# EAGLE design Keypad 4x4 (EAGLE 9.6.2)
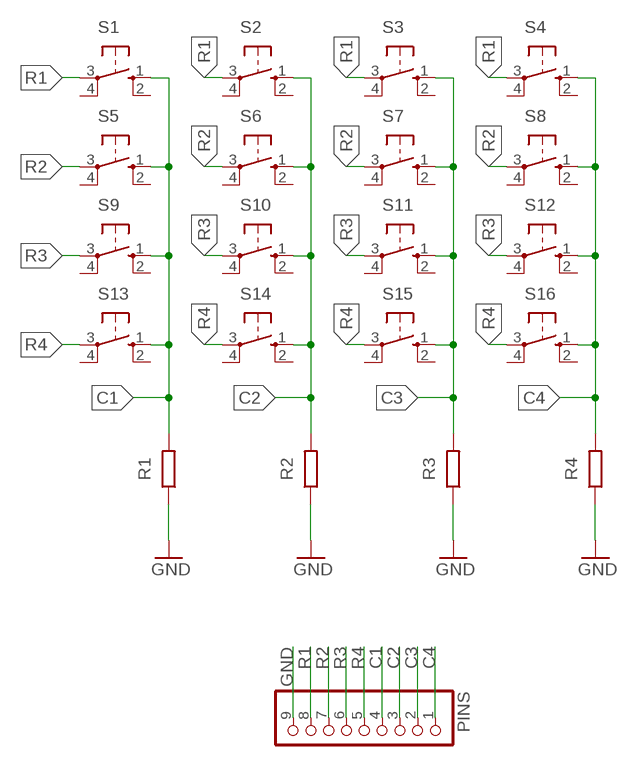
[diagram p0: schematic, sheet 1]

## Parts
PINS  PINHD-1X9/90  [1X09/90]
R1  100k  R-EU_0204/7  [0204/7]
R2  100k  R-EU_0204/7  [0204/7]
R3  100k  R-EU_0204/7  [0204/7]
R4  100k  R-EU_0204/7  [0204/7]
S1  10-XX  [B3F-10XX]
S2  10-XX  [B3F-10XX]
S3  10-XX  [B3F-10XX]
S4  10-XX  [B3F-10XX]
S5  10-XX  [B3F-10XX]
S6  10-XX  [B3F-10XX]
S7  10-XX  [B3F-10XX]
S8  10-XX  [B3F-10XX]
S9  10-XX  [B3F-10XX]
S10  10-XX  [B3F-10XX]
S11  10-XX  [B3F-10XX]
S12  10-XX  [B3F-10XX]
S13  10-XX  [B3F-10XX]
S14  10-XX  [B3F-10XX]
S15  10-XX  [B3F-10XX]
S16  10-XX  [B3F-10XX]

## Nets
C1: PINS.4 R1.2 S1.1(S) S5.1(S) S9.1(S) S13.1(S)
C2: PINS.3 R2.2 S2.1(S) S6.1(S) S10.1(S) S14.1(S)
C3: PINS.2 R3.2 S3.1(S) S7.1(S) S11.1(S) S15.1(S)
C4: PINS.1 R4.2 S4.1(S) S8.1(S) S12.1(S) S16.1(S)
GND: PINS.9 R1.1 R2.1 R3.1 R4.1
R1: PINS.8 S1.3(P) S2.3(P) S3.3(P) S4.3(P)
R2: PINS.7 S5.3(P) S6.3(P) S7.3(P) S8.3(P)
R3: PINS.6 S9.3(P) S10.3(P) S11.3(P) S12.3(P)
R4: PINS.5 S13.3(P) S14.3(P) S15.3(P) S16.3(P)
Unconnected: S1.2(S1) S1.4(P1) S2.2(S1) S2.4(P1) S3.2(S1) S3.4(P1) S4.2(S1) S4.4(P1) S5.2(S1) S5.4(P1) S6.2(S1) S6.4(P1) S7.2(S1) S7.4(P1) S8.2(S1) S8.4(P1) S9.2(S1) S9.4(P1) S10.2(S1) S10.4(P1) S11.2(S1) S11.4(P1) S12.2(S1) S12.4(P1) S13.2(S1) S13.4(P1) S14.2(S1) S14.4(P1) S15.2(S1) S15.4(P1) S16.2(S1) S16.4(P1)

## Library data of the parts
PINS = pinhead:PINHD-1X9: PIN HEADER
R1-R4 = rcl:R-EU_: RESISTOR, European symbol; SPICEPREFIX: R
S1-S16 = switch-omron:10-XX: OMRON SWITCH; MPN: B3F-1000; OC_FARNELL: 176432; OC_NEWARK: 36M3542

## Board
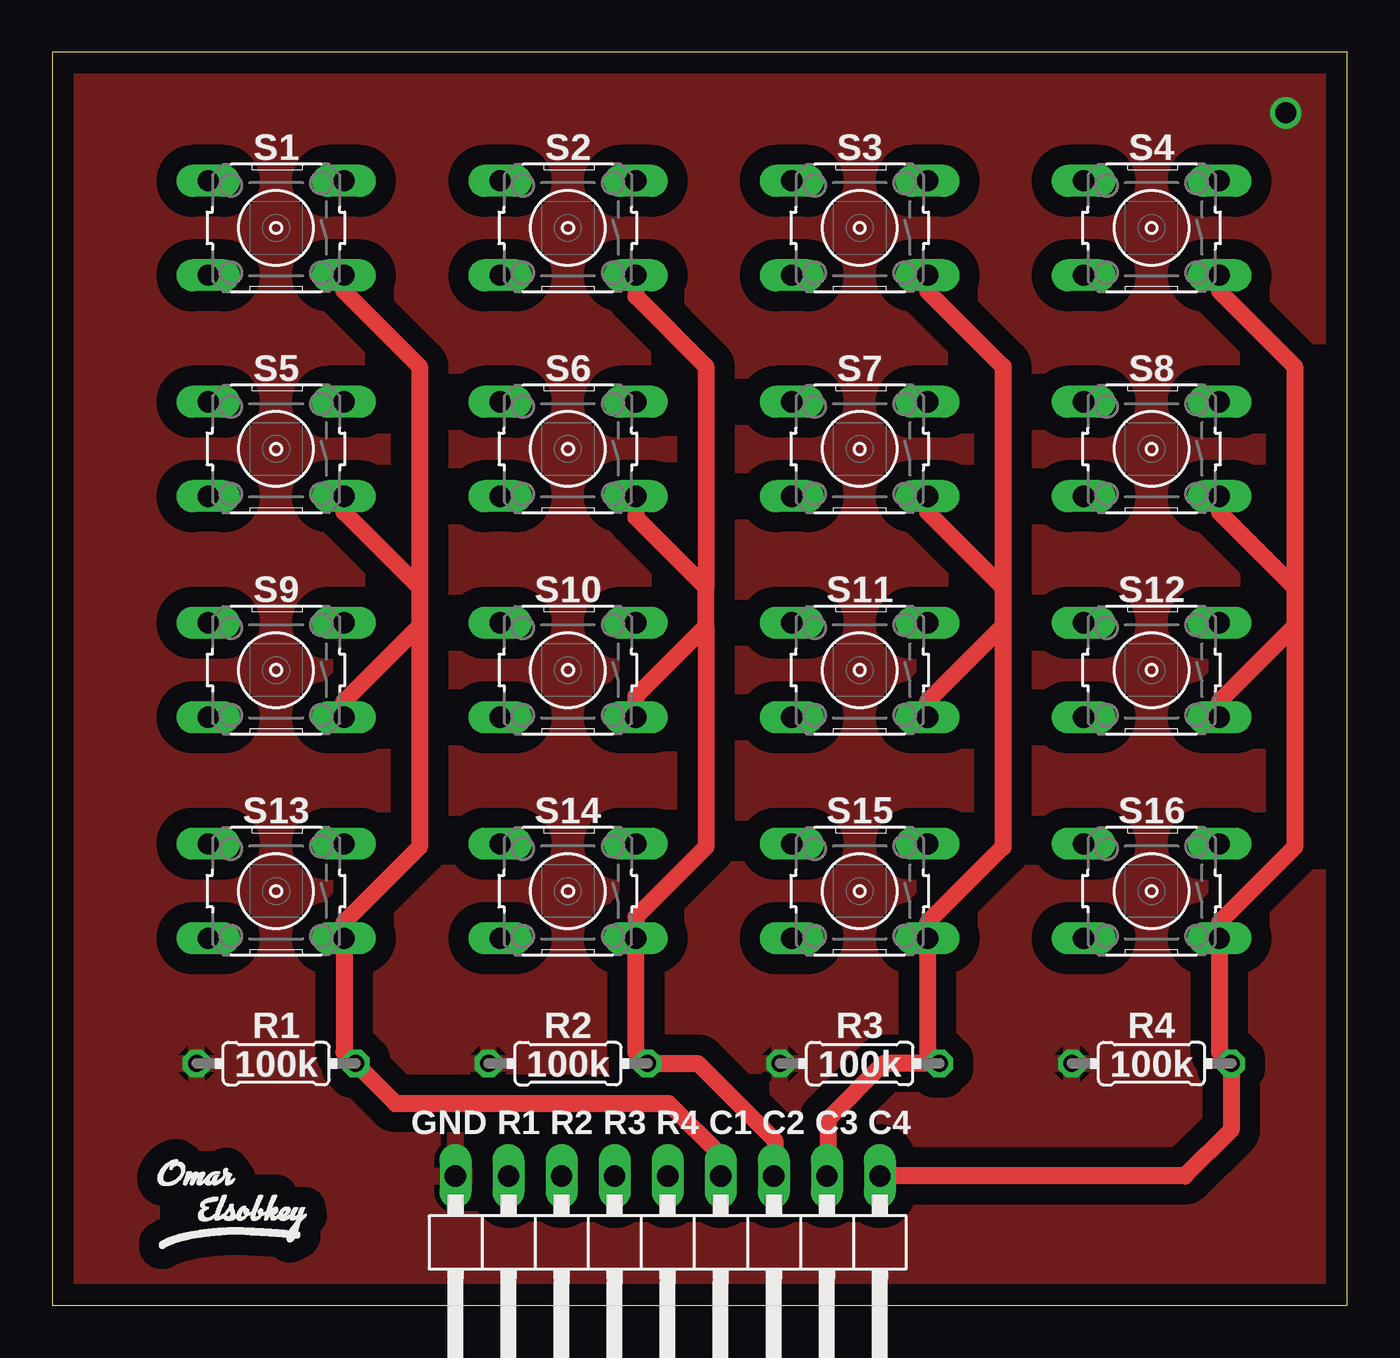
[diagram p1: board, top side]
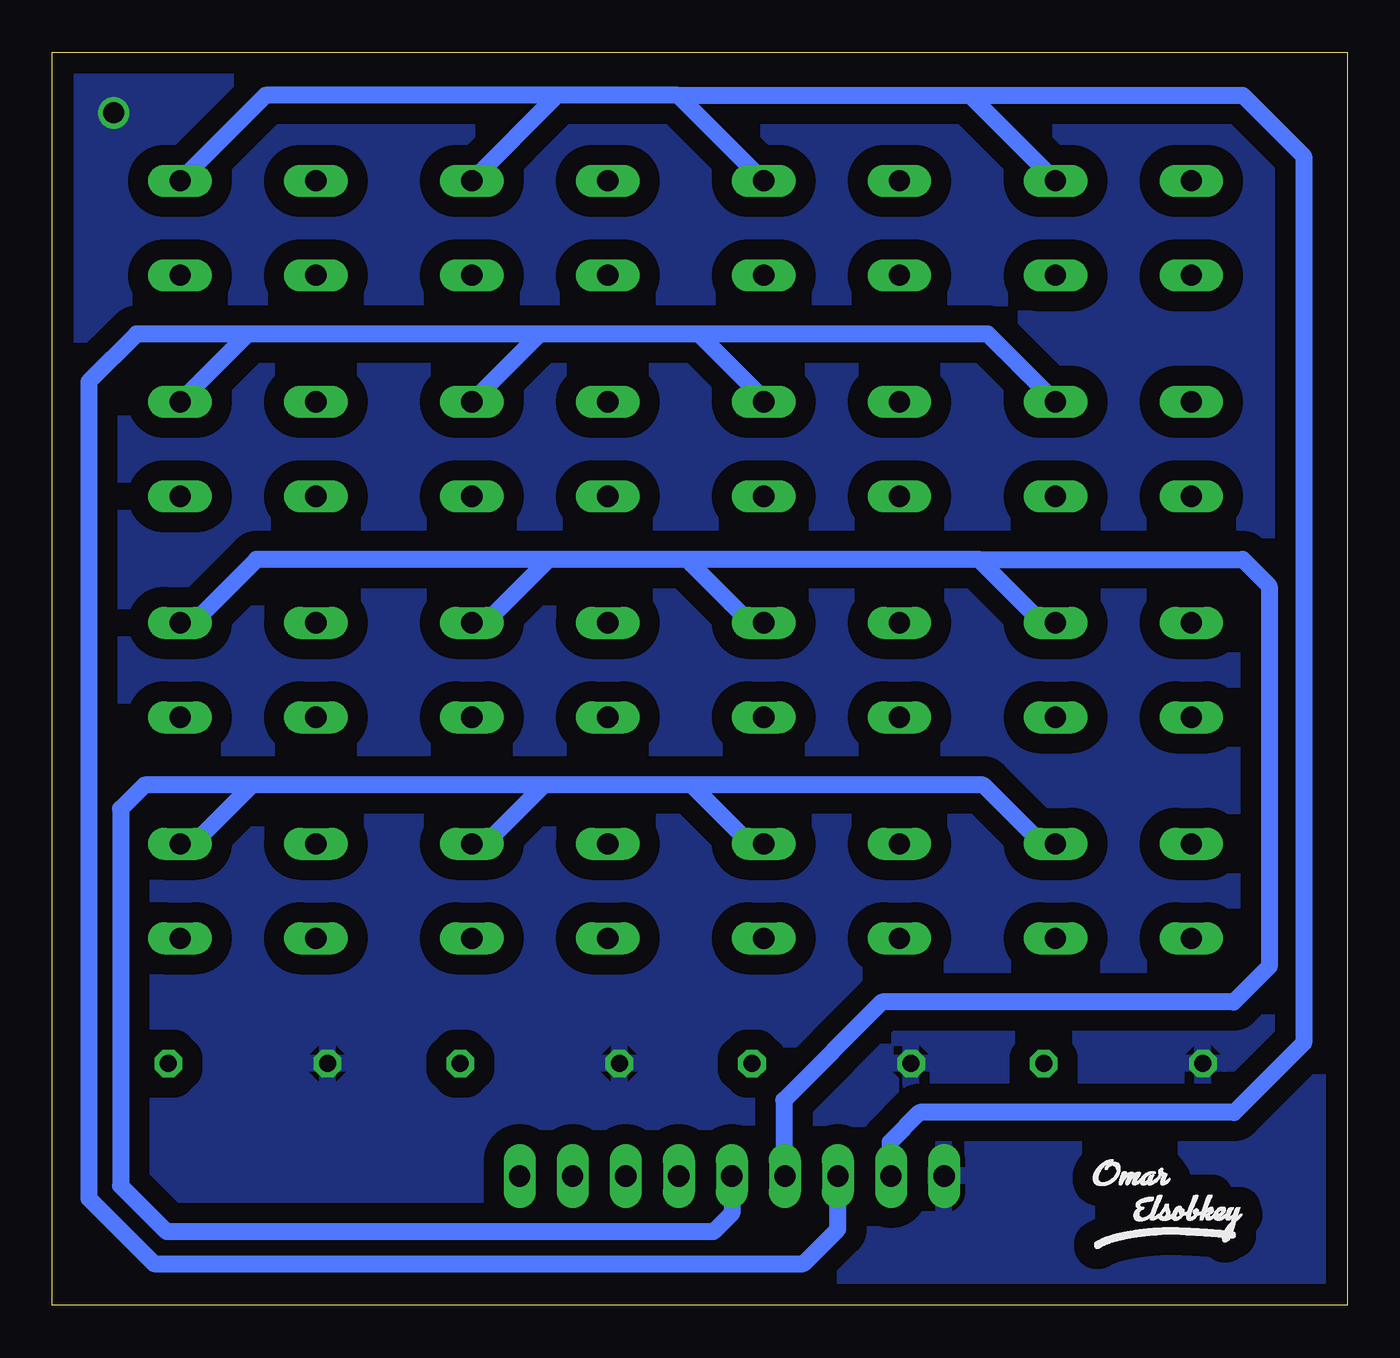
[diagram p2: board, bottom side, seen from below]

Size 62 x 60 mm. Coordinates in mm from the lower left corner, seen from the top.
Outline: 0,0 62,0 62,60 0,60 0,0
Copper layers (1*16): Top 0.035mm / dielectric 1.5mm / Bottom 0.035mm
Design rules "default *": minimum track width 0.8mm, minimum drill 0.7mm, track to track 0.6mm, track to pad 0.6mm, pad to pad 0.6mm, via to via 0.6mm, smd to smd 0.6mm, copper to edge 40mil, drill to drill 6mil, minimum pad ring 10mil, minimum via ring 8mil, stop-mask expansion 4mil, vias tented up to drill 0mil, thermal gap 10mil

### Footprints (pad centres in the part's own frame; a part is rotated, then mirrored left to right if it is on the bottom)
1X09/90 = drill 1.016 long: 1 -10.16,-3.81; 2 -7.62,-3.81; 3 -5.08,-3.81; 4 -2.54,-3.81; 5 0,-3.81; 6 2.54,-3.81; 7 5.08,-3.81; 8 7.62,-3.81; 9 10.16,-3.81
0204/7 = drill 0.813 octagon: 1 -3.81,0; 2 3.81,0
B3F-10XX = drill 1.016 long: 1 -3.251,2.261; 2 3.251,2.261; 3 -3.251,-2.261; 4 3.251,-2.261

### Placement (x,y rotation side)
PINS  29.46,2.39 180 top
R1  10.72,11.58 0 top
R2  24.69,11.58 0 top
R3  38.66,11.58 0 top
R4  52.63,11.58 0 top
S1  10.72,51.59 180 top
S2  24.69,51.59 180 top
S3  38.66,51.59 180 top
S4  52.63,51.59 180 top
S5  10.72,41 180 top
S6  24.69,41 180 top
S7  38.66,41 180 top
S8  52.63,41 180 top
S9  10.72,30.42 180 top
S10  24.69,30.42 180 top
S11  38.66,30.42 180 top
S12  52.63,30.42 180 top
S13  10.72,19.84 180 top
S14  24.69,19.84 180 top
S15  38.66,19.84 180 top
S16  52.63,19.84 180 top
U$1  [OMAR_ELSOBKEY_X0.5_T]  8.27,4.66 0 top
U$2  [OMAR_ELSOBKEY_X0.5_T]  8.95,4.66 0 bottom
U$3  [OMAR_ELSOBKEY_X0.5_TN]  8.95,4.66 0 bottom
U$4  [OMAR_ELSOBKEY_X0.5_TN]  8.27,4.66 0 top

### Tracks (layer width: path | path; a pad name or v marks a point on that pad's centre or on a via)
C1
  Top 0.813: S1.1 13.97,48.56 17.58,44.96 17.58,34.38 | 17.58,32.53 17.58,21.95 13.97,18.34 S13.1 13.97,12.14 R1.2 16.43,9.68 29.52,9.68 32.05,7.14 32.05,6.25 PINS.4 | S5.1 13.97,37.98 17.58,34.38 | 17.58,34.38 17.58,32.53 | 17.58,32.53 13.97,28.92 S9.1
C2
  Top 0.813: S2.1 27.94,48.31 31.29,44.96 31.29,34.38 | 31.29,32.53 31.29,21.95 27.94,18.59 S14.1 27.94,12.14 R2.2 30.91,11.58 34.59,7.9 34.59,6.25 PINS.3 | 31.29,34.38 27.94,37.73 S6.1 | 31.29,32.53 27.94,29.18 S10.1 | 31.29,32.53 31.29,34.38
C3
  Top 0.813: S3.1 41.91,48.56 45.52,44.96 45.52,34.38 | 45.52,32.53 45.52,21.95 41.91,18.34 S15.1 41.91,12.14 R3.2 39.8,11.58 37.13,8.91 37.13,6.25 PINS.2 | 45.52,34.38 41.91,37.98 S7.1 | 45.52,34.38 45.52,32.53 | 45.52,32.53 41.91,28.92 S11.1
C4
  Top 0.813: S4.1 55.88,48.56 59.49,44.96 59.49,34.38 | 59.49,34.38 59.49,32.53 | 59.49,32.53 59.49,21.95 55.88,18.34 S16.1 55.88,12.14 R4.2 56.44,8.41 54.23,6.2 PINS.1 | S8.1 55.88,37.98 59.49,34.38 | S12.1 55.88,28.92 59.49,32.53
GND  (via drill 1 pad 1.5)
  other vias: 59.05,57.1
  pour Top (isolate 0.965): -2.51,70.84 69.37,70.84 69.37,-5.99 -2.51,-5.99
  pour Bottom (isolate 0.965): -6.07,72.87 72.92,72.87 72.92,-9.8 -6.07,-9.8
R1
  Bottom 0.813: S1.3 18.06,57.94 | S4.3 51.79,57.94 37.82,57.94 | 32.03,57.94 18.06,57.94 | 32.03,57.94 37.82,57.94 | S2.3 32.03,57.94 | S3.3 37.82,57.94 | 18.06,57.94 5,57.94 2.08,55.02 2.08,12.57 5.41,9.25 20.47,9.25 21.89,7.82 21.89,6.25 PINS.8
R2
  Bottom 0.813: S5.3 17.21,46.51 31.04,46.51 | S8.3 52.64,46.51 | 31.04,46.51 38.67,46.51 | 38.67,46.51 52.64,46.51 | S7.3 38.67,46.51 | S6.3 27.94,43.41 31.04,46.51 | 52.64,46.51 57.96,46.51 60.25,44.22 60.25,5.13 57.12,2.01 26.04,2.01 24.38,3.66 PINS.7
R3
  Bottom 0.813: 17.64,35.71 14.61,32.68 S9.3 | S12.3 55.24,32.68 52.21,35.71 38.24,35.71 | 17.64,35.71 31.61,35.71 | 31.61,35.71 38.24,35.71 | 31.61,35.71 28.57,32.68 S10.3 | S11.3 41.27,32.68 38.24,35.71 | 17.64,35.71 5,35.71 3.73,34.44 3.73,16.23 5.44,14.53 22.28,14.53 26.98,9.83 26.98,6.25 PINS.6
R4
  Bottom 0.813: S13.3 14.61,22.1 17.42,24.92 31.39,24.92 | S16.3 55.24,22.1 52.43,24.92 | 31.39,24.92 38.46,24.92 | 38.46,24.92 52.43,24.92 | S15.3 41.27,22.1 38.46,24.92 | S14.3 28.57,22.1 31.39,24.92 | 52.43,24.92 57.58,24.92 58.73,23.77 58.73,5.74 56.52,3.53 30.35,3.53 29.46,4.42 PINS.5 29.46,4.93

### Text on the board
tNames: GND R1 R2 R3 R4 C1 C2 C3 C4